# EAGLE design SchematicOscillator (EAGLE 9.3.0)
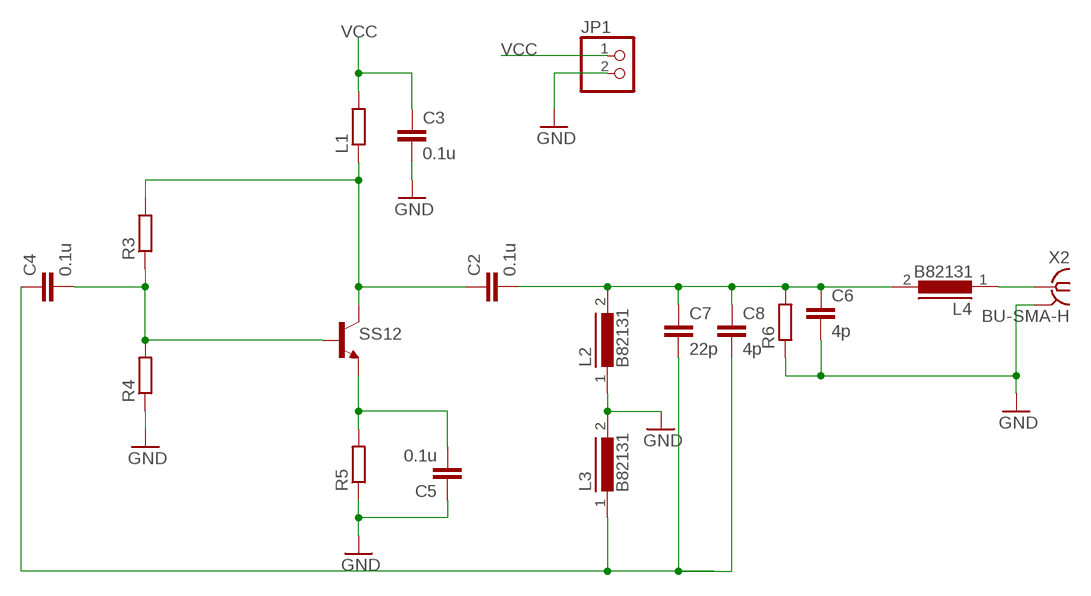
[diagram p0: schematic, sheet 1]

## Parts
C2  0.1u  C-EUC0805  [C0805]
C3  0.1u  C-EUC0805  [C0805]
C4  0.1u  C-EUC0805  [C0805]
C5  0.1u  C-EUC0805  [C0805]
C6  4p  C-EUC1206  [C1206]
C7  22p  C-EUC0805  [C0805]
C8  4p  C-EUC1206  [C1206]
JP1  PINHD-1X2  [1X02]
L1  R-EU_M0805  [M0805]
L2  B82131  [SUKW1-17]
L3  B82131  [SUKW1-17]
L4  B82131  [SUKW1-17]
R3  R-EU_R1206  [R1206]
R4  R-EU_R1206  [R1206]
R5  R-EU_R1206  [R1206]
R6  R-EU_R1206  [R1206]
SS12  -NPN-TO92  [TO92]
X2  BU-SMA-H  [BU-SMA-H]

## Nets
GND: C3.2 C5.1 C6.2 JP1.2 L2.1 L3.2 R4.1 R5.1 R6.1 X2.2 X2.3 X2.4 X2.5
N$2: C2.1 L1.1 R3.2 SS12.3(C)
N$4: C5.2 R5.2 SS12.1(E)
N$5: C4.2 R3.1 R4.2 SS12.2(B)
N$6: L4.1 X2.1
N$7: C2.2 C6.1 C7.1 C8.1 L2.2 L4.2 R6.2
N$8: C4.1 C7.2 C8.2 L3.1
VCC: C3.1 JP1.1 L1.2

## Library data of the parts
C2-C8 = rcl:C-EU: CAPACITOR, European symbol; SPICEPREFIX: C
JP1 = pinhead:PINHD-1X2: PIN HEADER
L1 = resistor:R-EU_: RESISTOR, European symbol
L2-L4 = inductors:B82131: INDUCTOR; SPICEPREFIX: L
R3-R6 = rcl:R-EU_: RESISTOR, European symbol; SPICEPREFIX: R
SS12 = transistor:*-NPN-: NPN Transistror BF959 corrected 2008.03.06
X2 = con-coax:BU-SMA-H: FEMALE SMA CONNECTOR Radiall; OC_FARNELL: unknown; OC_NEWARK: unknown

## Board
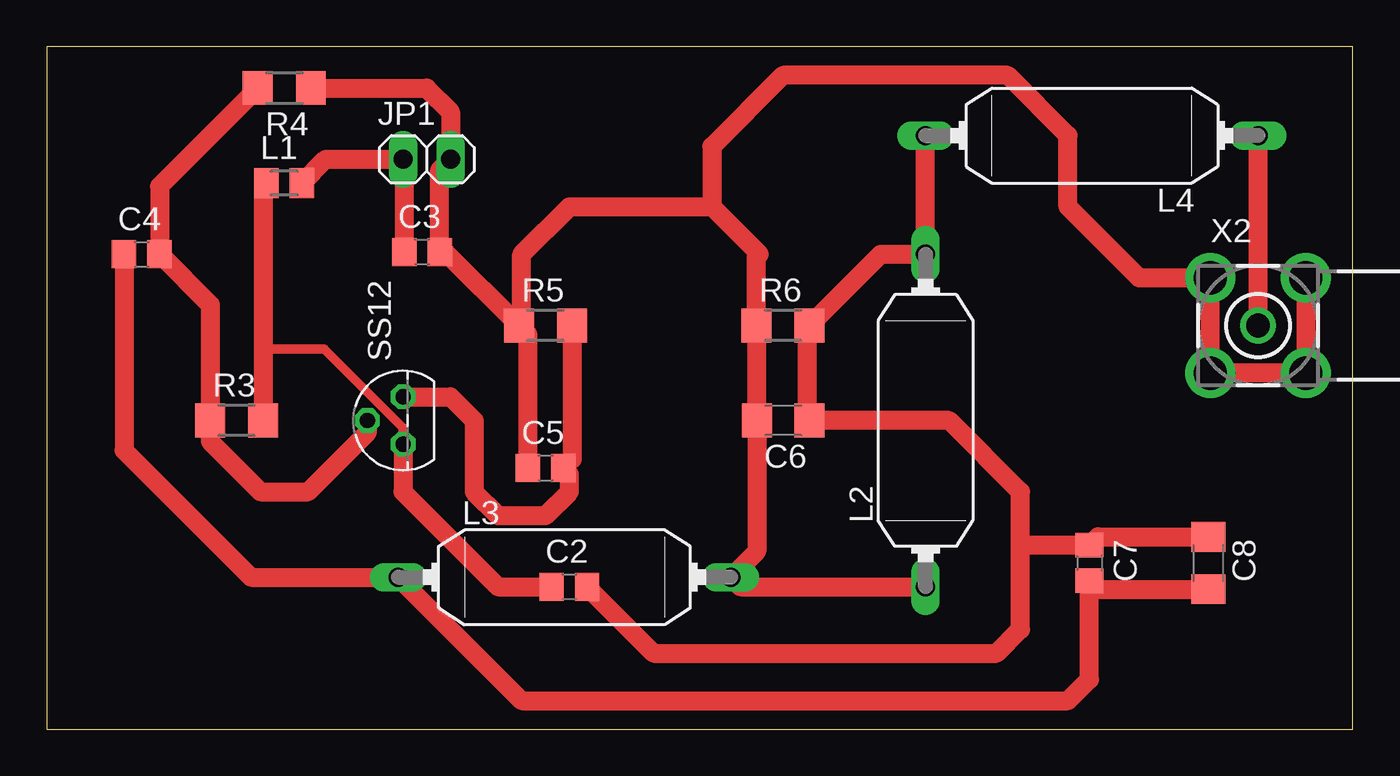
[diagram p1: board, top side]

Size 69.83 x 36.5 mm. Coordinates in mm from the lower left corner, seen from the top.
Outline: 0,0 69.83,0 69.83,36.5 0,36.5 0,0
Copper layers (1*16): Top 0.035mm / dielectric 1.5mm / Bottom 0.035mm
Design rules "default *": minimum track width 20mil, minimum drill 0.35mm, track to track 6mil, track to pad 6mil, pad to pad 6mil, via to via 6mil, smd to smd 6mil, copper to edge 40mil, drill to drill 6mil, minimum pad ring 10mil, minimum via ring 8mil, stop-mask expansion 4mil, vias tented up to drill 0mil, thermal gap 10mil

### Footprints (pad centres in the part's own frame; a part is rotated, then mirrored left to right if it is on the bottom)
C0805 = smd 1.3 x 1.5: 1 -0.95,0; 2 0.95,0
C1206 = smd 1.6 x 1.8: 1 -1.4,0; 2 1.4,0
1X02 = drill 1.016 long: 1 -1.27,0; 2 1.27,0
M0805 = smd 1.3 x 1.6: 1 -0.95,0; 2 0.95,0
SUKW1-17 = drill 1.016 long: 1 -8.89,0; 2 8.89,0
R1206 = smd 1.6 x 1.803: 1 -1.422,0; 2 1.422,0
TO92 = drill 0.813 octagon: 1 1.27,0; 2 0,1.905; 3 -1.27,0
BU-SMA-H = drill 1.27: 1 0,0 | drill 1.778: 2 -2.55,2.55; 3 2.55,2.55; 4 2.55,-2.55; 5 -2.55,-2.55

### Placement (x,y rotation side)
C2  27.94,7.62 0 top
C3  20.07,25.53 0 top
C4  5.08,25.4 0 top
C5  26.67,13.97 0 top
C6  39.37,16.51 180 top
C7  55.75,8.89 270 top
C8  62.1,8.89 270 top
JP1  20.32,30.48 0 top
L1  12.7,29.21 0 top
L2  46.99,16.51 90 top
L3  27.69,8.13 0 top
L4  55.88,31.75 180 top
R3  10.16,16.51 0 top
R4  12.7,34.29 180 top
R5  26.67,21.59 0 top
R6  39.37,21.59 0 top
SS12  19.05,16.51 90 top
X2  64.77,21.59 0 top

### Tracks (layer width: path | path; a pad name or v marks a point on that pad's centre or on a via)
GND
  Top 1.016: R4.1 20.32,34.29 21.59,33.02 JP1.2 21.02,29.91 C3.2 21.31,25.53 R5.1 | R5.1 25.72,21.12 C5.1 | R5.1 25.4,21.74 25.4,25.4 27.94,27.94 35.56,27.94 | 35.56,27.94 38.1,25.4 37.95,25.25 R6.1 37.95,16.53 C6.2 37.97,9.52 L3.2 37.08,7.62 L2.1 | X2.3 X2.4 X2.5 X2.2 58.41,24.14 54.61,27.94 54.61,31.75 51.38,34.98 39.37,34.98 35.56,31.17 35.56,27.94
N$2
  Top 0.508: 11.58,20.32 14.84,20.32 19.05,16.11 SS12.3
  Top 1.016: L1.1 11.58,29.04 11.58,20.32 R3.2 | SS12.3 19.05,12.7 24.13,7.62 C2.1
N$4
  Top 1.016: R5.2 28.09,14.44 C5.2 27.94,13.65 27.94,12.7 26.67,11.43 24.13,11.43 22.86,12.7 22.86,16.51 21.59,17.78 SS12.1
N$5
  Top 1.016: R4.2 6.03,29.04 C4.2 8.74,22.69 R3.1 8.74,15.39 11.43,12.7 13.97,12.7 17.14,15.88 SS12.2
N$6
  Top 1.016: X2.1 L4.1
N$7
  Top 1.016: C2.2 32.45,4.06 50.8,4.06 52.07,5.33 52.07,10.16 | 52.07,10.16 52.07,12.7 48.26,16.51 C6.1 40.64,16.51 40.64,21.44 R6.2 44.6,25.4 L2.2 L4.2 | 52.07,10.16 52.39,9.84 C7.1 56.2,10.29 C8.1
N$8
  Top 1.016: C4.1 4.13,14.92 10.92,8.13 L3.1 25.4,1.52 54.61,1.52 55.75,2.67 C7.2 56.2,7.49 C8.2
VCC
  Top 1.016: C3.1 19.12,30.41 JP1.1 14.92,30.48 L1.2